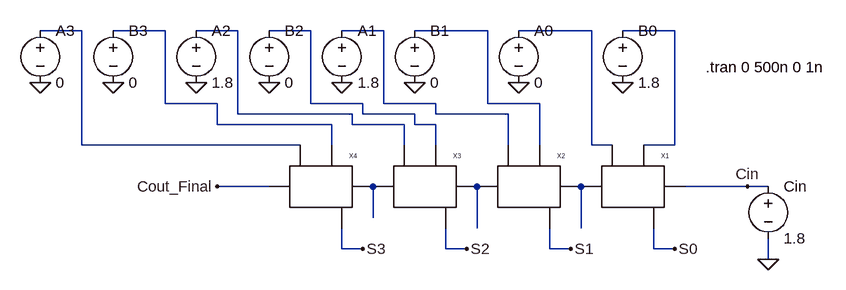
[diagram p0: schematic 4Bit_Ripple_Carry_Adder.asc]
4Bit_Ripple_Carry_Adder.asc, the LTspice schematic file:
Version 4.1
SHEET 1 880 680
WIRE -496 -64 -560 -64
WIRE -368 -64 -448 -64
WIRE -256 -64 -320 -64
WIRE -144 -64 -208 -64
WIRE -32 -64 -96 -64
WIRE 128 -64 16 -64
WIRE 288 -64 176 -64
WIRE 416 -64 336 -64
WIRE -368 48 -368 -64
WIRE -288 48 -368 48
WIRE -144 48 -144 -64
WIRE -64 48 -144 48
WIRE -32 48 -32 -64
WIRE 48 48 -32 48
WIRE 128 48 128 -64
WIRE 208 48 128 48
WIRE -256 64 -256 -64
WIRE -80 64 -256 64
WIRE -64 64 -64 48
WIRE 16 64 -64 64
WIRE 48 64 48 48
WIRE 160 64 48 64
WIRE -288 80 -288 48
WIRE -112 80 -288 80
WIRE -80 80 -80 64
WIRE 0 80 -80 80
WIRE 16 80 16 64
WIRE 48 80 16 80
WIRE -496 112 -496 -64
WIRE -160 112 -496 112
WIRE -112 112 -112 80
WIRE 0 112 0 80
WIRE 48 112 48 80
WIRE 160 112 160 64
WIRE 208 112 208 48
WIRE 288 112 288 -64
WIRE 320 112 288 112
WIRE 416 112 416 -64
WIRE 416 112 368 112
WIRE -208 176 -288 176
WIRE 528 176 432 176
WIRE 560 176 528 176
WIRE -48 224 -48 176
WIRE 112 240 112 176
WIRE 272 240 272 176
WIRE -96 272 -96 240
WIRE -64 272 -96 272
WIRE 64 272 64 240
WIRE 96 272 64 272
WIRE 224 272 224 240
WIRE 256 272 224 272
WIRE 384 272 384 240
WIRE 416 272 384 272
WIRE 560 288 560 256
FLAG 560 288 0
FLAG 416 272 S0
FLAG 256 272 S1
FLAG 96 272 S2
FLAG -64 272 S3
FLAG 336 16 0
FLAG 176 16 0
FLAG 16 16 0
FLAG -96 16 0
FLAG -208 16 0
FLAG -320 16 0
FLAG -448 16 0
FLAG -560 16 0
FLAG -288 176 Cout_Final
FLAG 528 176 Cin
SYMBOL CMOS_FULL_ADDER 336 176 R0
SYMATTR InstName X1
SYMBOL CMOS_FULL_ADDER 176 176 R0
SYMATTR InstName X2
SYMBOL CMOS_FULL_ADDER 16 176 R0
SYMATTR InstName X3
SYMBOL CMOS_FULL_ADDER -144 176 R0
SYMATTR InstName X4
SYMBOL voltage 560 160 R0
WINDOW 123 0 0 Left 0
WINDOW 39 0 0 Left 0
SYMATTR InstName Cin
SYMATTR Value 1.8
SYMBOL voltage -96 -80 R0
WINDOW 123 0 0 Left 0
WINDOW 39 0 0 Left 0
SYMATTR InstName A1
SYMATTR Value 1.8
SYMBOL voltage 16 -80 R0
SYMATTR InstName B1
SYMATTR Value 0
SYMBOL voltage 176 -80 R0
WINDOW 123 0 0 Left 0
WINDOW 39 0 0 Left 0
SYMATTR InstName A0
SYMATTR Value 0
SYMBOL voltage 336 -80 R0
WINDOW 123 0 0 Left 0
WINDOW 39 0 0 Left 0
SYMATTR InstName B0
SYMATTR Value 1.8
SYMBOL voltage -208 -80 R0
SYMATTR InstName B2
SYMATTR Value 0
SYMBOL voltage -320 -80 R0
SYMATTR InstName A2
SYMATTR Value 1.8
SYMBOL voltage -448 -80 R0
WINDOW 123 0 0 Left 0
WINDOW 39 0 0 Left 0
SYMATTR InstName B3
SYMATTR Value 0
SYMBOL voltage -560 -80 R0
SYMATTR InstName A3
SYMATTR Value 0
TEXT 464 -8 Left 2 !.tran 0 500n 0 1n

The netlist it stands for:
* 4Bit_Ripple_Carry_Adder.asc
X§X1 Cin S0 N007 N008 N011 CMOS_FULL_ADDER  ; pins Cin Sum A B Cout
X§X2 N011 S1 N005 N006 N010 CMOS_FULL_ADDER  ; pins Cin Sum A B Cout
X§X3 N010 S2 N003 N004 N009 CMOS_FULL_ADDER  ; pins Cin Sum A B Cout
X§X4 N009 S3 N001 N002 Cout_Final CMOS_FULL_ADDER  ; pins Cin Sum A B Cout
V§Cin Cin 0 1.8
V§A1 N005 0 1.8
V§B1 N006 0 0
V§A0 N007 0 0
V§B0 N008 0 1.8
V§B2 N004 0 0
V§A2 N003 0 1.8
V§B3 N002 0 0
V§A3 N001 0 0
.tran 0 500n 0 1n
.backanno
.end